# Altium schematic sheet peripherals.SchDoc
size A4
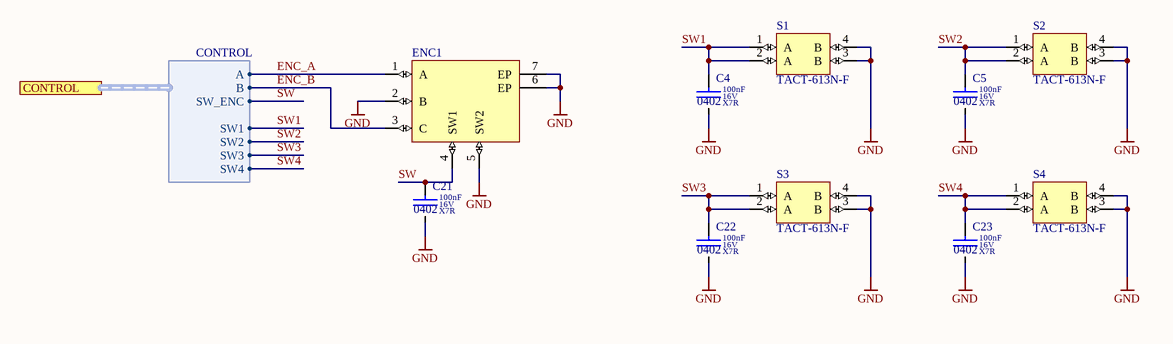
[diagram p0: peripherals.SchDoc]

## Parts
C4  value 100nF  Dielectric: X7R  Voltage: 16V  SCH_Footprint: 0402  [C_0402_1005]  (hidden comment: Ceramic X7R)
C5  value 100nF  Dielectric: X7R  Voltage: 16V  SCH_Footprint: 0402  [C_0402_1005]  (hidden comment: Ceramic X7R)
C21  value 100nF  Dielectric: X7R  Voltage: 16V  SCH_Footprint: 0402  [C_0402_1005]  (hidden comment: Ceramic X7R)
C22  value 100nF  Dielectric: X7R  Voltage: 16V  SCH_Footprint: 0402  [C_0402_1005]  (hidden comment: Ceramic X7R)
C23  value 100nF  Dielectric: X7R  Voltage: 16V  SCH_Footprint: 0402  [C_0402_1005]  (hidden comment: Ceramic X7R)
ENC1  Wurth Elektronik 482016514001  [ENCODER]  (value not drawn)
S1  TACT-613N-F  [TACT-613N-F]
S2  TACT-613N-F  [TACT-613N-F]
S3  TACT-613N-F  [TACT-613N-F]
S4  TACT-613N-F  [TACT-613N-F]

## Ports
CONTROL (harness CONTROL)

## Harnesses
CONTROL: A, B, SW_ENC, SW1, SW2, SW3, SW4

## Nets
GND: C4.2 C5.2 C21.2 C22.2 C23.2 ENC1.2(B) ENC1.5(SW2) ENC1.6(EP) ENC1.7(EP) S1.3(B) S1.4(B) S2.3(B) S2.4(B) S3.3(B) S3.4(B) S4.3(B) S4.4(B)
ENC_A: ENC1.1(A) ; port CONTROL.A
ENC_B: ENC1.3(C) ; port CONTROL.B
SW: C21.1 ENC1.4(SW1) ; port CONTROL.SW_ENC
SW1: C4.1 S1.1(A) S1.2(A) ; port CONTROL.SW1
SW2: C5.1 S2.1(A) S2.2(A) ; port CONTROL.SW2
SW3: C22.1 S3.1(A) S3.2(A) ; port CONTROL.SW3
SW4: C23.1 S4.1(A) S4.2(A) ; port CONTROL.SW4

## Library data of the parts
C4 C5 C21-C23 = C_100nF_16V_X7R_0402_10: Capacitor; Manufacturer: Murata; Manufacturer Part Number: GRM155R71C104KA88D; Tolerance (%): 10; Part Number: C_100nF_16V_X7R_0402_10; HelpURL: https://www.mouser.com/ds/2/281/c02e-2905.pdf; Supplier 1: TME; Supplier 2: RS Components; Supplier 3: Farnell; Supplier 4: Mouser; Supplier Part Number 4: 81-GRM155R71C104KA88; Supplier 5: Digi-Key
ENC1 = ENCODER